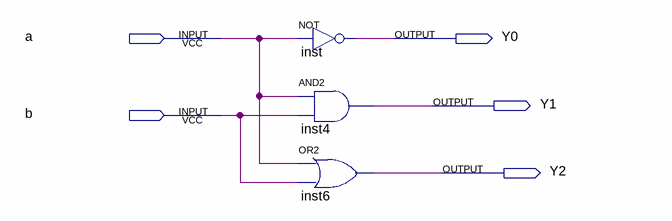
[diagram p0: schematic sheet]
// Quartus schematic 913019.bdf as structural Verilog: 3 symbols, 5 pins
module \913019  (
  input  a,
  input  b,
  output Y0,
  output Y1,
  output Y2
);

  not inst (Y0, a);
  and inst4 (Y1, a, b);
  or inst6 (Y2, a, b);
endmodule
